# EAGLE design riffleito-KAP-REVA (EAGLE 6.5.0)
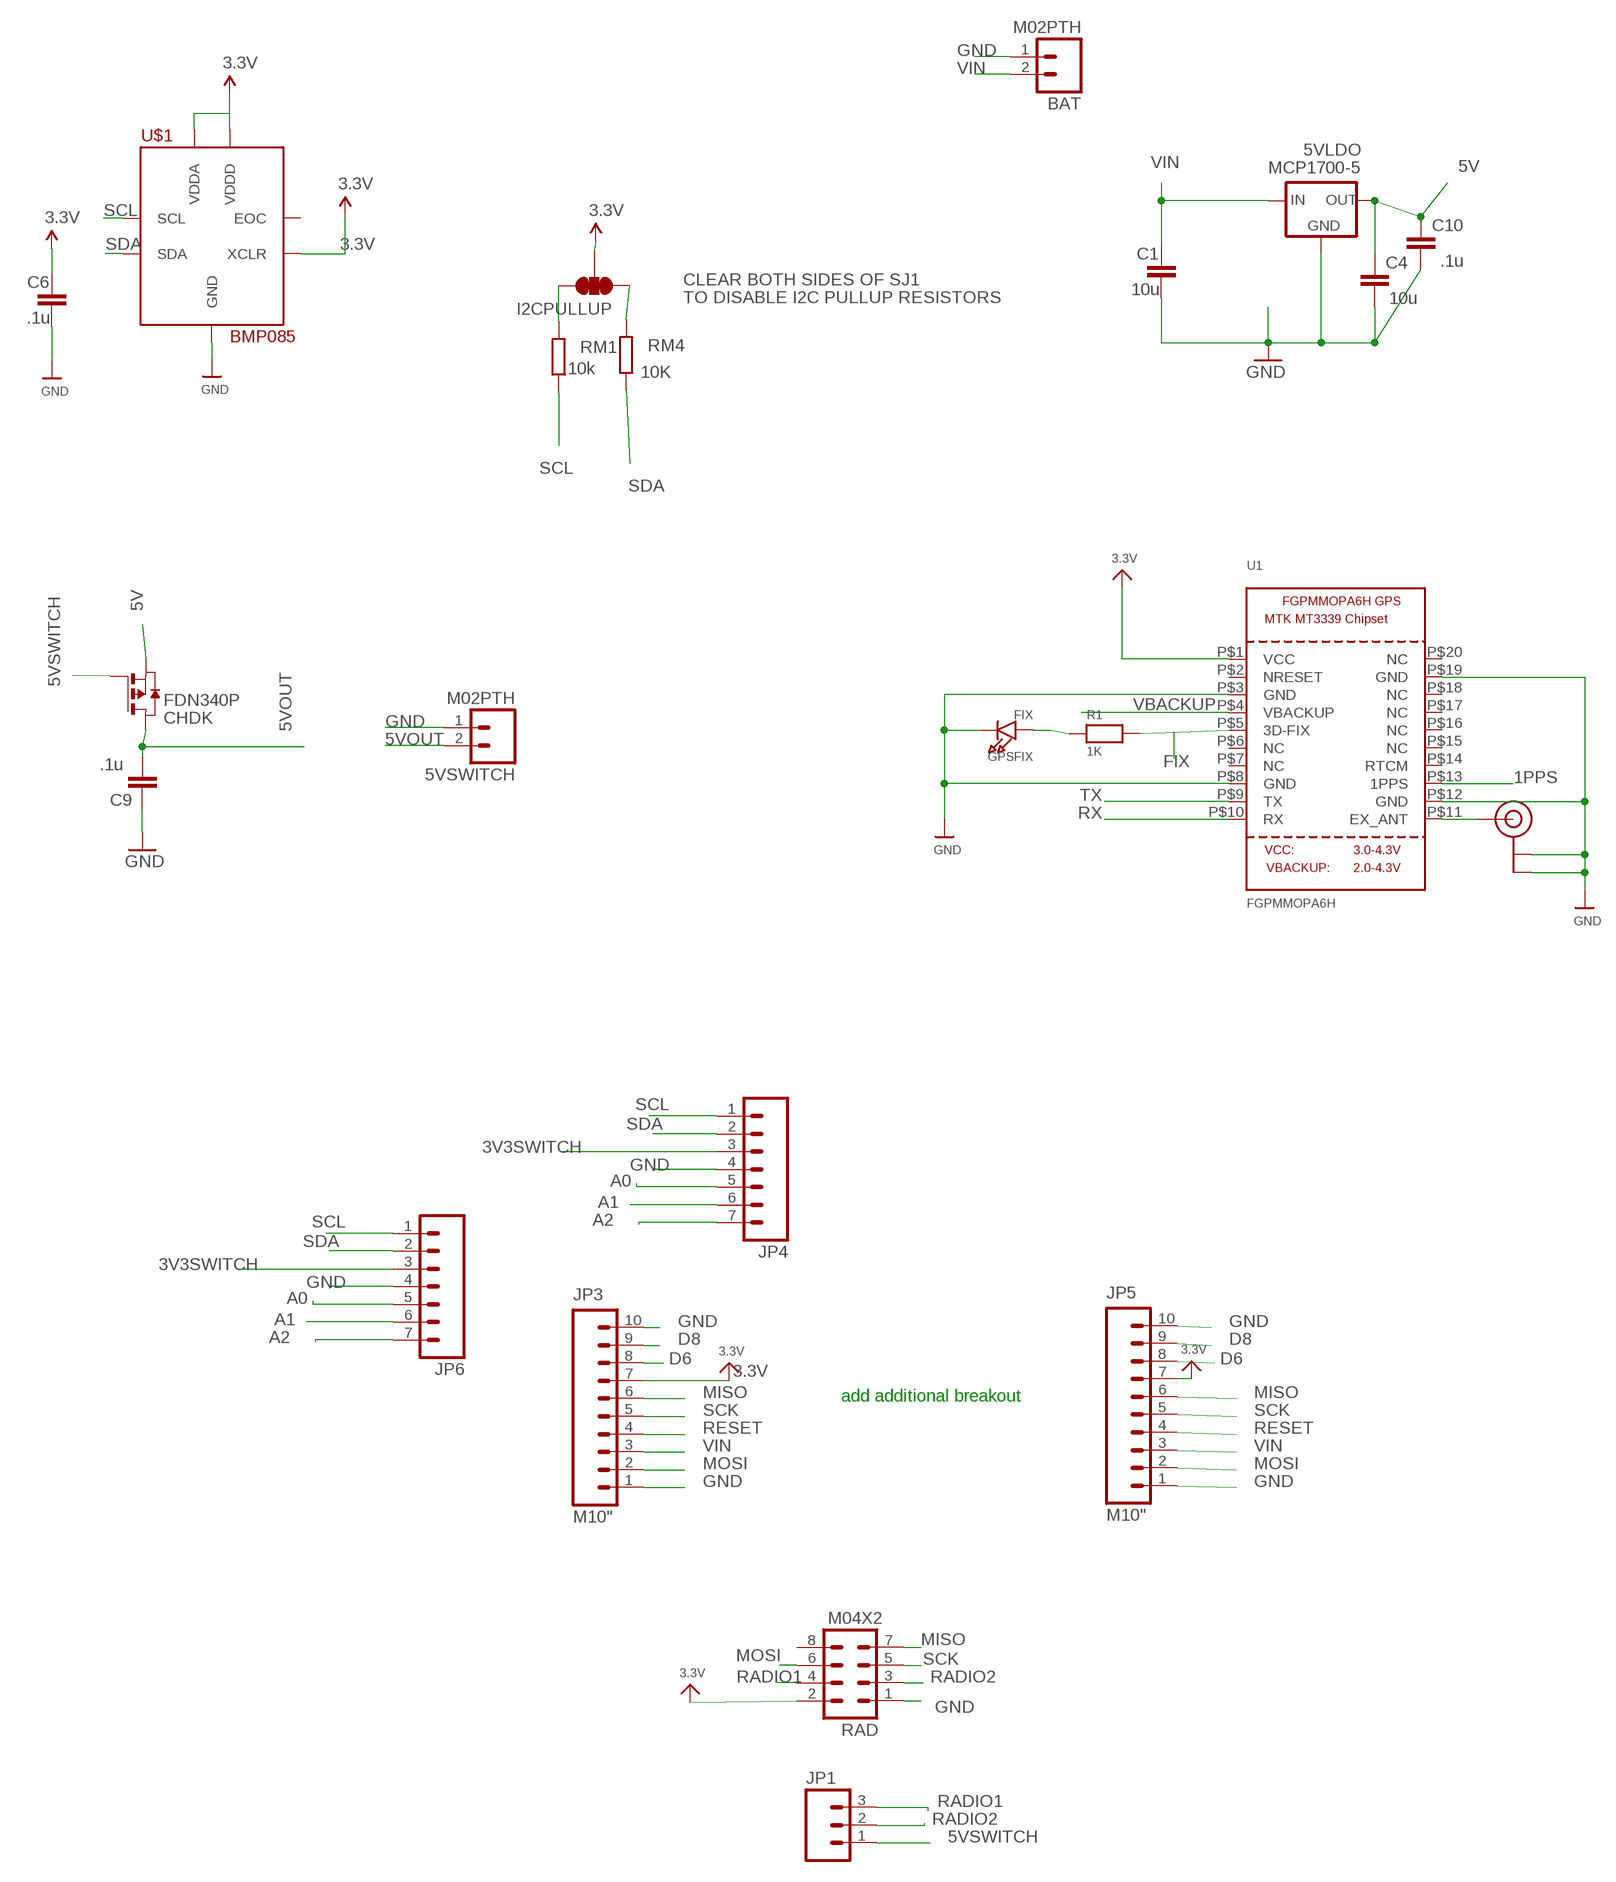
[diagram p0: schematic, sheet 1]

## Parts
5VLDO  MCP1700-5  MCP1700SOT233  [SOT23]
5VSWITCH  M02PTH  [1X02]
BAT  M02PTH  [1X02]
C1  10u  C-EUC0805  [C0805]
C4  10u  C-EUC0805  [C0805]
C6  .1u  C-EUC0805  [C0805]
C9  .1u  C-EUC0805  [C0805]
C10  .1u  C-EUC0805  [C0805]
CHDK  FDN340P  PMOSSOT23  [SOT-23]
GPSFIX  FIX  LED0805  [CHIPLED_0805]
I2CPULLUP  SOLDERJUMPER_2WAYPASTE1&2&3  [SJ_3_PASTE1&2&3]
JP1  M03PTH  [1X03]
JP3  M10"  [1X10]
JP4  M07  [1X07]
JP5  M10"  [1X10]
JP6  M07  [1X07]
R1  1K  RESISTOR0805  [0805]
RAD  M04X2  [2X4]
RM1  10k  R-EU_R0805  [R0805]
RM4  10K  R-EU_R0805  [R0805]
U1  FGPMMOPA6H  GPS_FGPMMOPA6H  [FGPMMOPA6H]
U$1  BMP085  [BMP085]
U$20  U.FL  [U.FL]

## Nets
1PPS: U1.P$13(1PPS)
3.3V: C6.1 I2CPULLUP.2 JP3.7 JP5.7 RAD.2 U1.P$1(VCC) U$1.P$3(VDDA) U$1.P$4(VDDD) U$1.P$8(XCLR)
3V3SWITCH: JP4.3 JP6.3
5V: 5VLDO.2(OUT) C4.1 C10.1 CHDK.2(S)
5VOUT: 5VSWITCH.2 C9.2 CHDK.1(D)
5VSWITCH: CHDK.3(G) JP1.1
A0: JP4.5 JP6.5
A1: JP4.6 JP6.6
A2: JP4.7 JP6.7
D6: JP3.8 JP5.8
D8: JP3.9 JP5.9
GND: 5VLDO.1(GND) 5VSWITCH.1 BAT.1 C1.2 C4.2 C6.2 C9.1 C10.2 GPSFIX.C JP3.1 JP3.10 JP4.4 JP5.1 JP5.10 JP6.4 RAD.1 U1.P$3(GND) U1.P$8(GND) U1.P$12(GND) U1.P$19(GND) U$1.P$1(GND) U$20.P$1(GND) U$20.P$2(GND)
MISO: JP3.6 JP5.6 RAD.7
MOSI: JP3.2 JP5.2 RAD.6
N$1: GPSFIX.A R1.1
N$2: R1.2 U1.P$5(3D-FIX)
N$3: I2CPULLUP.3 RM1.2
N$4: U1.P$11(EX_ANT) U$20.P$3(SIGNAL)
N$9: I2CPULLUP.1 RM4.2
RADIO1: JP1.3 RAD.4
RADIO2: JP1.2 RAD.3
RESET: JP3.4 JP5.4
RX: U1.P$10(RX)
SCK: JP3.5 JP5.5 RAD.5
SCL: JP4.1 JP6.1 RM1.1 U$1.P$6(SCL)
SDA: JP4.2 JP6.2 RM4.1 U$1.P$7(SDA)
TX: U1.P$9(TX)
VBACKUP: U1.P$4(VBACKUP)
VIN [power]: 5VLDO.3(IN) BAT.2 C1.1 JP3.3 JP5.3
Unconnected: RAD.8 U1.P$2(NRESET) U1.P$6(NC) U1.P$7(NC) U1.P$14(RTCM) U1.P$15(NC) U1.P$16(NC) U1.P$17(NC) U1.P$18(NC) U1.P$20(NC) U$1.P$2(EOC)

## Notes on the sheet
- CLEAR BOTH SIDES OF SJ1
- TO DISABLE I2C PULLUP RESISTORS
- add additional breakout

## Library data of the parts
5VLDO = adafruit:MCP1700: VOLTAGE REGULATOR
5VSWITCH BAT = SparkFun-Connectors:M02: Standard 2-pin 0.1" header. Use with - straight break away headers ( PRT-00116) - right angle break away headers (PRT-00553) - swiss pins (PRT-00743) - machine pins (PRT-00117) - female headers (PRT-00115) Molex polarized connector foot print use with: PRT-08233 with associated crimp pins and housings. 2.54_SCREWTERM for use with PRT-10571. 3.5mm Screw Terminal footprints for PRT-08084 5mm Screw Terminal footprints for use with PRT-08433
C1 C4 C6 C9 C10 = resistor:C-EU: CAPACITOR, European symbol
CHDK = zetex:PMOSSOT23: MOS FET
GPSFIX = microbuilder:LED: LED 0603 - 0603 Surface Mount Package 2mA: Green LED - Low Power (3.9mcd, 2ma, 1.7Vf) - Digikey: 475-2709-2-ND Orange LED - Low Power (9.8mcd, 2ma, 1.8Vf) - Digikey: 475-1194-2-ND Red LED - Low Power (5mcd, 2ma, 1.8Vf) - Digikey: 475-1195-2-ND Yellow LED - Low Power (7mcd, 2ma, 1.8Vf) - Digikey: 475-1196-2-ND 5mA: Blue LED - Low Power (17mcd, 5ma, 2.9Vf) - Digikey: LNJ937W8CRACT-ND 0805 - 0805 Surface Mount Package 2mA: Red LED (8.8mcd, 2mA, 1.8Vf, Clear) - Low Power [Digikey: 475-2510-1-ND] Green LED (5mcd, 2mA, 1.8Vf, Clear) - Low Power [Digikey: 475-2730-1-ND] Yellow LED (11.3mcd, 2mA, 1.8Vf, Clear) - Low Power [Digikey: 475-2555-1-ND] 20mA: Red LED (104mcd, 20mA, Diffused) - LS R976 [Digikey: 475-1278-6-ND] Red LED (12mcd, 20mA, 2.0Vf, Clear) - APT2012EC [Digikey: 754-1128-1-ND] Green LED (15mcd, 20mA, 2.2Vf, Clear) - APT2012GC [Digikey: 754-1131-1-ND] Orange LED (160mcd, 20mA, 2.1Vf, Clear) - APT2012SECK [Digikey: 754-1130-1-ND] 1206 - 1206 Surface Mount Package Green LED (26mcd, 20mA, Diffused) - LG N971 [Digikey: 475-1407-6-ND] Red LED (15mcd, 20mA, Diffused) - LH N974 [Digikey: 475-1416-6-ND]
I2CPULLUP = mike-temp:SOLDERJUMPER_2WAY: Solder Jumper 2 way solder jumper
JP1 = SparkFun-Connectors:M03: Header 3 Standard 3-pin 0.1" header. Use with straight break away headers (SKU : PRT-00116), right angle break away headers (PRT-00553), swiss pins (PRT-00743), machine pins (PRT-00117), and female headers (PRT-00115). Molex polarized connector foot print use with SKU : PRT-08232 with associated crimp pins and housings.
JP3 JP5 = SparkFun-Connectors:M10: Header 10 Standard 10-pin 0.1" header. Use with straight break away headers (SKU : PRT-00116), right angle break away headers (PRT-00553), swiss pins (PRT-00743), machine pins (PRT-00117), and female headers (PRT-00115).
JP4 JP6 = SparkFun-Connectors:M07: Header 7 Standard 7-pin 0.1" header. Use with straight break away headers (SKU : PRT-00116), right angle break away headers (PRT-00553), swiss pins (PRT-00743), machine pins (PRT-00117), and female headers (PRT-00115). NOTES ON THE VARIANTS LOCK and LOCK_LONGPADS... This footprint was designed to help hold the alignment of a through-hole component (i.e. 7-pin header) while soldering it into place. You may notice that each hole has been shifted either up or down by 0.005 of an inch from it's more standard position (which is usually a perfectly straight line). This slight alteration caused the pins (the squares in the middle) to touch the edges of the holes. Because they are alternating, it causes a "brace" to hold the header in place. 0.005 has proven to be the perfect amount of "off-center" position when using our standard breakaway headers. Although looks a little odd when you look at the bare footprint, once you have a header in there, the alteration is very hard to notice. Also, if you push a header all the way into place, it is covered up entirely on the bottom side. This idea of altering the position of holes to aid alignment will be further integrated into the Sparkfun Library for other footprints. It can help hold any component with 3 or more connection pins.
R1 = microbuilder:RESISTOR: Resistors 0402 - 0402 Surface Mount Package 22 Ohm 1% 1/16W [Digikey: 311-22.0LRTR-ND] 33 Ohm 5% 1/16W 1.0K 5% 1/16W 1.5K 5% 1/16W 2.0K 1% 1/16W 10.0K 1% 1/16W [Digikey: 311-10.0KLRTR-ND] 10.0K 5% 1/16W [Digikey: RMCF0402JT10K0TR-ND] 12.1K 1% 1/16W [Digikey: 311-22.0LRTR-ND] 100.0K 5% 1/16W 0603 - 0603 Surface Mount Package 0 Ohm 1/10 Watt 1% Resistor 15 Ohm 1/10 Watt 1% Resistor 33 Ohm 1/10 Watt 1% Resistor 49.9 Ohm 1/10 Watt 1% Resistor 100 Ohm 1/10 Watt 1% Resistor 150 Ohm 1/10 Watt 1% Resistor 240 Ohm 1/10 Watt 1% Resistor 390 Ohm 1/10 Watt 1% Resistor 560 Ohm 1/10 Watt 1% Resistor 680 Ohm 1/10 Watt 1% Resistor 750 Ohm 1/10 Watt 1% Resistor 1.0K Ohm 1/10 Watt 1% Resistor 1.5K Ohm 1/10 Watt 1% Resistor 2.0K Ohm 1/10 Watt 1% Resistor 2.2K Ohm 1/10 Watt 1% Resistor 3.3K Ohm 1/10 Watt 1% Resistor 4.7K Ohm 1/10 Watt 1% Resistor 10.0K Ohm 1/10 Watt 1% Resistor 12.0K Ohm 1/10 Watt 1% Resistor 12.1K Ohm 1/10 Watt 1% Resistor 20.0K Ohm 1/10 Watt 1% Resistor 33.0K Ohm 1/10 Watt 1% Resistor 100.0K Ohm 1/10 Watt 1% Resistor 0805 - 0805 Surface Mount Package 0 Ohm 1/8 Watt 1% Resistor 33 Ohm 1/8 Watt 1% Resistor 100 Ohm 1/8 Watt 1% Resistor 150 Ohm 1/8 Watt 1% Resistor 200 Ohm 1/8 Watt 1% Resistor 240 Ohm 1/8 Watt 1% Resistor 330 Ohm 1/8 Watt 1% Resistor 390 Ohm 1/8 Watt 1% Resistor 470 Ohm 1/8 Watt 1% Resistor 1.0K Ohm 1/8 Watt 1% Resistor 1.5K Ohm 1/8 Watt 1% Resistor 2.0K Ohm 1/8 Watt 1% Resistor 4.7K Ohm 1/8 Watt 1% Resistor 5.1K Ohm 1/8 Watt 1% Resistor 5.6K Ohm 1/8 Watt 1% Resistor 10.0K Ohm 1/8 Watt 1% Resistor 22.0K Ohm 1/8 Watt 1% Resistor 33.0K Ohm 1/8 Watt 1% Resistor 100K Ohm 1/8 Watt 1% Resistor 1206 - 1206 Surface Mount Package 2012 - 2010 Surface Mount Package 0.11 Ohm 1/2 Watt 1% Resistor - Digikey: RHM.11UCT-ND
RAD = SparkFun-Connectors:M04X2: .1" header, two rows of four.
RM1 RM4 = rcl:R-EU_: RESISTOR, European symbol
U1 = microbuilder:GPS_FGPMMOPA6H: GPS Module - MTK MT3339 Chipset, -165dBm sensitivity, 22 channels, 10Hz, auto-select external antenna options
U$1 = JeeLabs:BMP085: BMP086 Bosch Digital Pressure Sensor
U$20 = microbuilder:U.FL: U.FL Antenna Connector

## Net classes
0 default: width 0.203 mm, drill 0.33 mm, clearance 0.203 mm
1 power: width 0.381 mm, drill 0.33 mm, clearance 0.254 mm

## Board
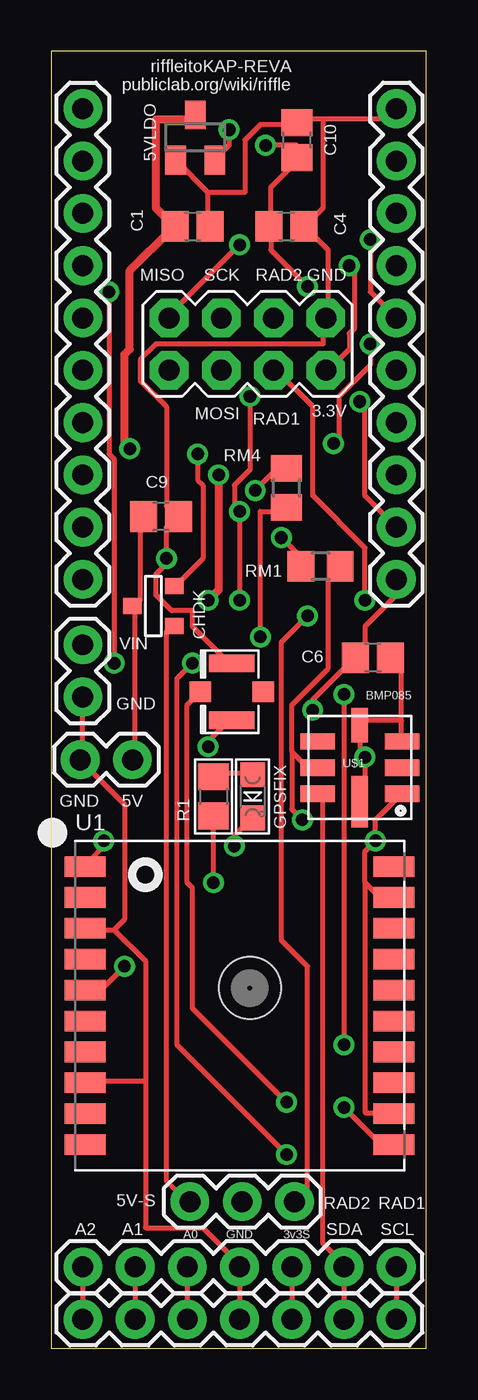
[diagram p1: board, top side]
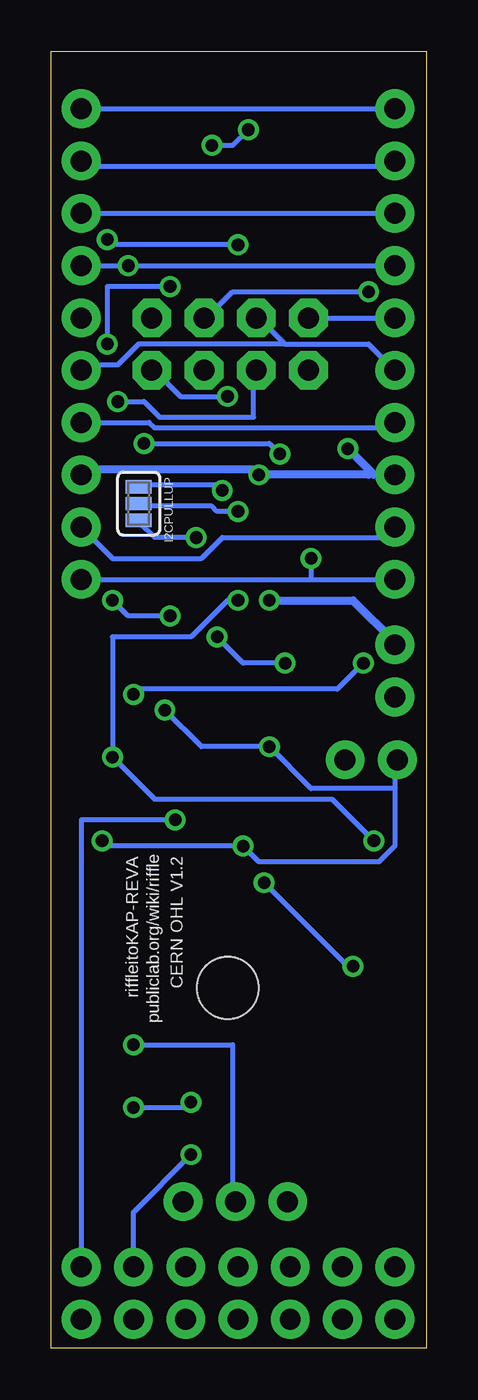
[diagram p2: board, bottom side, seen from below]

Size 18.21 x 62.98 mm. Coordinates in mm from the lower left corner, seen from the top.
Outline: 0,0 18.21,0 18.21,62.98 0,62.98 0,0
Copper layers (1*16): Top 0.035mm / dielectric 1.5mm / Bottom 0.035mm
Design rules "default": minimum track width 10mil, minimum drill 24mil, track to track 8mil, track to pad 8mil, pad to pad 8mil, via to via 8mil, smd to smd 8mil, copper to edge 40mil, drill to drill 8mil, minimum pad ring 10mil, minimum via ring 8mil, stop-mask expansion 4mil, vias tented up to drill 0mil, thermal gap 10mil

### Footprints (pad centres in the part's own frame; a part is rotated, then mirrored left to right if it is on the bottom)
SOT23 = smd 1 x 1.4: 1 -0.95,-1.1; 2 0.95,-1.1; 3 0,1.1
1X02 = drill 1.016 pad 1.88: 1 0,0; 2 2.54,0
C0805 = smd 1.3 x 1.5: 1 -0.85,0; 2 0.85,0
SOT-23 = smd 0.787 x 0.889: 1 0.025,-1.016; 2 -0.94,1.016; 3 0.991,1.016
CHIPLED_0805 = smd 1.2 x 1.2: A 0,-1.05; C 0,1.05
SJ_3_PASTE1&2&3 = smd 0.635 x 1.27: 1 -0.813,0; 2 0,0; 3 0.813,0
1X03 = drill 1.016 pad 1.88: 1 0,0; 2 2.54,0; 3 5.08,0
1X10 = drill 1.016 pad 1.88: 1 0,0; 2 2.54,0; 3 5.08,0; 4 7.62,0; 5 10.16,0; 6 12.7,0; 7 15.24,0; 8 17.78,0; 9 20.32,0; 10 22.86,0
1X07 = drill 1.016 pad 1.88: 1 0,0; 2 2.54,0; 3 5.08,0; 4 7.62,0; 5 10.16,0; 6 12.7,0; 7 15.24,0
0805 = smd 1.3 x 1.5: 1 -0.95,0; 2 0.95,0
2X4 = drill 1.016 pad 1.88 octagon: 1 -3.81,-1.27; 2 -3.81,1.27; 3 -1.27,-1.27; 4 -1.27,1.27; 5 1.27,-1.27; 6 1.27,1.27; 7 3.81,-1.27; 8 3.81,1.27
R0805 = smd 1.3 x 1.5: 1 -0.95,0; 2 0.95,0
FGPMMOPA6H = smd 2 x 1: P$1 -7.5,6.75; P$2 -7.5,5.25; P$3 -7.5,3.75; P$4 -7.5,2.25; P$5 -7.5,0.75; P$6 -7.5,-0.75; P$7 -7.5,-2.25; P$8 -7.5,-3.75; P$9 -7.5,-5.25; P$10 -7.5,-6.75; P$11 7.5,-6.75; P$12 7.5,-5.25; P$13 7.5,-3.75; P$14 7.5,-2.25; P$15 7.5,-0.75; P$16 7.5,0.75; P$17 7.5,2.25; P$18 7.5,3.75; P$19 7.5,5.25; P$20 7.5,6.75 | hole 3: 0.5,0.85
BMP085 = smd 1.68 x 0.8: P$1 -2.06,1.27; P$2 -2.06,0; P$3 -2.06,-1.27; P$5 2.04,-1.27; P$6 2.04,0; P$7 2.04,1.27 | smd 0.8 x 1.68: P$4 0,-2.06 | smd 0.8 x 2.5: P$8 0,1.65
U.FL = smd 2.2 x 0.85: P$1 0,1.375; P$2 0,-1.375 | smd 1.05 x 1: P$3 1.525,0; P$4 -1.525,0

### Placement (x,y rotation side)
5VLDO  6.99,58.8 0 top
5VSWITCH  1.4,28.57 0 top
BAT  1.52,31.62 90 top
C1  6.86,54.48 0 top
C4  11.43,54.48 0 top
C6  15.62,33.53 180 top
C9  5.33,40.39 180 top
C10  11.94,58.67 90 top
CHDK  4.95,36.07 270 top
GPSFIX  9.78,26.8 180 top
I2CPULLUP  13.97,41.02 270 bottom
JP1  6.73,7.11 0 top
JP3  16.76,37.34 90 top
JP4  16.76,3.94 180 top
JP5  1.52,37.34 90 top
JP6  16.76,1.4 180 top
R1  7.87,26.8 270 top
RAD  9.53,48.77 180 top
RM1  13.08,37.97 180 top
RM4  11.43,41.78 90 top
U1  9.14,16.64 0 top
U$1  14.99,28.19 180 top
U$20  8.76,31.88 180 top

### Tracks (layer width: path | path; a pad name or v marks a point on that pad's centre or on a via)
3.3V  (via drill 0.61)
  Top 0.254: 17.02,30.48 17.02,29.46 U$1.P$3 | 17.02,30.48 17.02,33.02 16.51,33.53 C6.1 | 17.02,30.48 14.99,30.48 U$1.P$4 14.99,28.96 v15.24,28.7 15.24,26.92 14.99,26.67 U$1.P$8 | v2.54,24.64 2.54,24.38 1.78,23.62 U1.P$1 | v9.65,46.23 9.65,42.67 8.89,41.91 8.89,40.89 v9.14,40.64 v9.14,36.32 | v14.48,52.58 14.73,52.32 14.73,49.53 14.48,49.28 14.48,48.51 13.46,47.5 RAD.2
  Bottom 0.254: v2.54,24.64 4.57,26.67 13.21,26.67 v15.24,28.7 15.24,34.54 11.43,34.54 9.65,36.32 v9.14,36.32 | v9.14,40.64 10.16,40.64 10.41,40.89 13.97,40.89 I2CPULLUP.2 | v9.65,46.23 11.94,46.23 13.21,47.5 RAD.2 | JP3.7 v14.48,52.58 JP5.7
3V3SWITCH
  Top 0.254: JP4.3 JP6.3
5V  (via drill 0.61)
  Top 0.254: v8.64,59.18 8.64,58.42 8.13,57.91 5VLDO.2 | v10.41,58.42 11.94,58.42 C10.1 11.94,57.66 10.67,56.39 10.67,54.61 C4.1 10.67,54.36 10.67,53.34 v12.45,51.56 | v7.11,43.43 7.11,42.16 7.37,41.91 7.37,38.35 6.1,37.08 CHDK.2 | v13.72,43.94 13.97,44.2 13.97,46.23 15.49,47.75 v15.49,48.77
  Bottom 0.254: v8.64,59.18 9.4,58.42 v10.41,58.42 | v7.11,43.43 7.62,43.94 v13.72,43.94 | v15.49,48.77 15.49,51.56 v12.45,51.56
5VOUT
  Top 0.254: C9.2 4.32,40.39 4.32,36.32 4.06,36.07 CHDK.1 4.06,35.81 4.06,28.7 5VSWITCH.2
5VSWITCH
  Top 0.254: CHDK.3 5.84,35.05 5.59,34.8 5.59,8.13 6.6,7.11 JP1.1
A0
  Top 0.254: JP4.5 JP6.5
A1
  Top 0.254: JP4.6 JP6.6
A2
  Top 0.254: JP4.7 JP6.7
D6
  Bottom 0.254: JP3.8 JP5.8
D8
  Bottom 0.254: JP5.9 1.78,57.4 16.51,57.4 JP3.9
GND  (via drill 0.61)
  Top 0.254: JP3.1 16.76,36.58 15.24,35.05 15.24,33.78 14.99,33.53 C6.2 14.73,33.53 12.7,31.5 v12.7,30.99 | 6.1,40.39 5.59,39.88 v5.59,38.35 5.59,38.1 5.08,37.59 5.08,36.58 5.84,35.81 6.86,35.81 6.86,35.05 8.64,33.27 U$20.P$2 | 7.62,56.13 6.1,57.66 5VLDO.1 | 7.62,56.13 7.62,54.61 C1.2 | 13.21,59.69 16.76,59.69 JP3.10 | 13.21,59.69 11.94,59.69 C10.2 11.94,59.44 10.16,59.44 9.4,58.67 9.4,56.13 7.62,56.13 | 13.21,59.69 13.21,55.37 12.45,54.61 C4.2 12.45,54.36 13.46,53.34 13.46,50.04 RAD.1 13.21,50.04 13.21,48.77 5.08,48.77 4.32,48.01 4.32,46.99 5.59,45.72 5.59,40.89 6.1,40.39 | 6.1,40.39 C9.1 | JP6.4 JP4.4 9.14,4.06 7.37,5.84 4.57,5.84 4.57,12.95 | 4.57,12.95 1.78,12.95 U1.P$8 | 4.57,12.95 4.57,18.8 3.05,20.32 | 3.05,20.32 1.78,20.32 U1.P$3 | 15.24,22.61 15.24,24.13 v15.75,24.64 15.75,25.65 17.02,26.92 U$1.P$1 | 15.24,22.61 15.75,22.1 16.51,22.1 U1.P$19 | 15.24,22.61 15.24,11.43 16.51,11.43 U1.P$12 | v8.89,24.38 8.89,24.89 9.65,25.65 GPSFIX.C | v7.62,29.21 7.62,29.46 8.64,30.48 U$20.P$1 | BAT.1 1.52,28.7 5VSWITCH.1 3.56,26.42 3.56,20.83 3.05,20.32
  Bottom 0.254: JP3.1 5.59,37.34 | 5.59,37.34 JP5.1 | JP3.10 JP5.10 | v5.59,38.35 5.59,37.34 | 1.52,27.18 1.52,28.45 5VSWITCH.1 | 1.52,27.18 1.52,24.38 2.29,23.62 8.13,23.62 v8.89,24.38 15.49,24.38 v15.75,24.64 | 1.52,27.18 5.59,27.18 v7.62,29.21 10.92,29.21 v12.7,30.99
MISO  (via drill 0.61)
  Top 0.254: JP3.6 15.49,51.31 v15.49,53.85 | v9.14,53.59 5.84,50.29 5.84,50.04 RAD.7
  Bottom 0.254: RAD.7 JP5.6 | v15.49,53.85 15.24,53.59 v9.14,53.59
MOSI  (via drill 0.61)
  Top 0.254: v14.99,45.97 15.24,45.72 15.24,41.4 JP3.2
  Bottom 0.254: JP5.2 2.03,39.37 9.91,39.37 10.92,38.35 15.24,38.35 JP3.2 | v14.99,45.97 13.72,45.97 12.95,45.21 8.38,45.21 8.38,47.5 RAD.6
N$1
  Top 0.254: GPSFIX.A 9.65,27.94 7.87,27.94 R1.1
N$2  (via drill 0.61)
  Top 0.254: v7.87,22.61 R1.2 | v3.56,18.54 2.54,17.53 1.78,17.53 U1.P$5
  Bottom 0.254: v7.87,22.61 3.81,18.54 v3.56,18.54
N$3  (via drill 0.61)
  Top 0.254: v11.18,39.37 11.94,38.61 11.94,38.1 RM1.2
  Bottom 0.254: v11.18,39.37 13.21,39.37 13.97,40.13 I2CPULLUP.3
N$4  (via drill 0.61)
  Top 0.254: v11.43,11.94 6.86,16.51 6.86,22.35 6.6,22.61 6.6,31.24 7.11,31.75 U$20.P$3 | v14.22,11.68 16,9.91 16.51,9.91 U1.P$11
  Bottom 0.254: v11.43,11.94 11.68,11.68 v14.22,11.68
N$9  (via drill 0.61)
  Top 0.254: v9.91,41.66 10.92,42.67 11.43,42.67 RM4.2
  Bottom 0.254: v9.91,41.66 10.16,41.91 13.97,41.91 I2CPULLUP.1
RADIO1  (via drill 0.61)
  Top 0.254: v15.24,36.32 15.24,38.86 12.7,41.4 12.7,45.72 10.92,47.5 RAD.4 | v12.45,35.56 11.18,34.29 11.18,19.81 12.45,18.54 12.45,7.62 11.94,7.11 JP1.3
  Bottom 0.254: v15.24,36.32 14.48,35.56 v12.45,35.56
RADIO2  (via drill 0.61)
  Top 0.254: v14.22,31.75 v14.22,14.73 | v3.05,33.27 3.05,43.18 2.79,43.43 v2.79,51.31
  Bottom 0.254: v14.22,14.73 9.4,14.73 9.4,7.11 JP1.2 | v14.22,31.75 13.97,32 4.32,32 v3.05,33.27 | v2.79,51.31 9.4,51.31 10.67,50.04 RAD.3
RESET
  Bottom 0.254: JP5.4 1.78,44.7 13.21,44.7 13.46,44.96 JP3.4
SCK
  Bottom 0.254: JP5.5 2.79,48.77 6.86,48.77 | 6.86,48.77 8.13,50.04 RAD.5 | JP3.5 16.51,47.75 14.99,47.75 13.97,48.77 6.86,48.77
SCL  (via drill 0.61)
  Top 0.254: JP4.1 JP6.1 | 11.68,28.96 11.68,31.24 13.46,33.02 13.46,37.34 13.97,37.85 RM1.1 | 11.68,28.96 12.45,28.19 U$1.P$6 | v12.19,25.65 11.68,26.16 11.68,28.96
  Bottom 0.254: JP4.1 16.76,25.65 v12.19,25.65
SDA  (via drill 0.61)
  Top 0.254: v10.16,34.54 10.16,40.64 11.43,40.64 RM4.1 | v6.86,33.27 6.1,32.51 6.1,14.73 v11.43,9.4 | U$1.P$7 13.21,26.67 13.21,5.08 14.22,4.06 JP4.2 JP6.2
  Bottom 0.254: v10.16,34.54 8.89,33.27 v6.86,33.27 | v11.43,9.4 14.22,6.6 JP4.2
VIN  (via drill 0.61)
  Top 0.381: 5VLDO.3 6.86,59.69 5.08,59.69 5.08,55.37 5.84,54.61 C1.1 5.84,54.36 3.81,52.32 3.81,48.51 3.56,48.26 3.56,43.94 v3.81,43.69 | v7.62,36.32 8.13,36.83 v8.13,42.42
  Bottom 0.381: 2.67,42.55 2.54,42.42 JP5.3 | 2.67,42.55 v3.81,43.69 | v7.62,36.32 3.56,36.32 1.52,34.29 BAT.2 | 2.67,42.55 2.79,42.42 v8.13,42.42 8.38,42.67 16.51,42.67 JP3.3

### Text on the board
tPlace: riffleitoKAP-REVA | publiclab.org/wiki/riffle | MISO | SCK | RAD2 | GND | MOSI | 3.3V | RAD1 | VIN | GND | GND | 5V | 5V-S | RAD2 | RAD1 | A2 | A1 | A0 | GND | 3v3S | SDA | SCL
bPlace: CERN OHL V1.2 | publiclab.org/wiki/riffle | riffleitoKAP-REVA